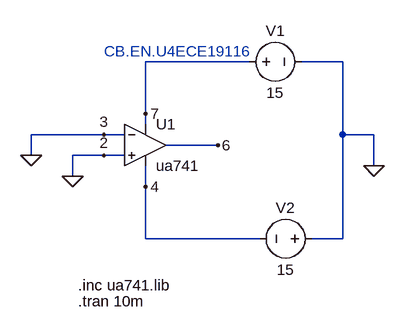
[diagram p0: schematic Draft1.asc]
Draft1.asc, the LTspice schematic file:
Version 4
SHEET 1 880 680
WIRE 304 16 144 16
WIRE 448 16 384 16
WIRE 144 96 144 16
WIRE 144 112 144 96
WIRE 80 128 -32 128
WIRE 112 128 80 128
WIRE 448 128 448 16
WIRE 496 128 448 128
WIRE 256 144 176 144
WIRE -32 160 -32 128
WIRE 80 160 32 160
WIRE 112 160 80 160
WIRE 496 176 496 128
WIRE 32 192 32 160
WIRE 144 208 144 176
WIRE 144 288 144 208
WIRE 320 288 144 288
WIRE 448 288 448 128
WIRE 448 288 400 288
FLAG 496 176 0
FLAG 80 128 3
FLAG 80 160 2
FLAG 256 144 6
FLAG 144 96 7
FLAG 144 208 4
FLAG -32 160 0
FLAG 32 192 0
SYMBOL voltage 288 16 R270
WINDOW 0 32 56 VTop 2
WINDOW 3 -32 56 VBottom 2
WINDOW 123 0 0 Left 0
WINDOW 39 0 0 Left 0
SYMATTR InstName V1
SYMATTR Value 15
SYMBOL voltage 416 288 R90
WINDOW 0 -32 56 VBottom 2
WINDOW 3 32 56 VTop 2
WINDOW 123 0 0 Left 0
WINDOW 39 0 0 Left 0
SYMATTR InstName V2
SYMATTR Value 15
SYMBOL OpAmps\\ua741 144 80 R0
SYMATTR InstName U1
TEXT 40 360 Left 2 !.inc ua741.lib
TEXT 40 384 Left 2 !.tran 10m
TEXT 80 0 Left 2 ;CB.EN.U4ECE19116

The netlist it stands for:
* Draft1.asc
V1 7 0 15
V2 0 4 15
XU1 0 0 7 4 6 ua741  ; pins In+ In- V+ V- OUT
.inc ua741.lib
.tran 10m
* CB.EN.U4ECE19116
.backanno
.end